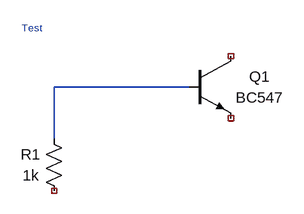
[diagram p0: schematic circuit.asc]
circuit.asc, the LTspice schematic file:
Version 4
SHEET 1 480 336
SYMBOL npn 448 336 R0
WINDOW 0 108 32 Center 2
WINDOW 3 108 64 Center 2
SYMATTR InstName Q1
SYMATTR Value BC547
SYMBOL res 224 448 R0
WINDOW 0 -20 40 Center 2
WINDOW 3 -20 72 Center 2
SYMATTR InstName R1
SYMATTR Value 1k
WIRE 240 384 240 464
WIRE 240 384 448 384
TEXT 190 292 Left 1 ;Test

The netlist it stands for:
* circuit.asc
Q1 NC_01 N001 NC_02 0 BC547
R1 N001 NC_03 1k
.model NPN NPN
.model PNP PNP
.lib standard.bjt
* Test
.backanno
.end